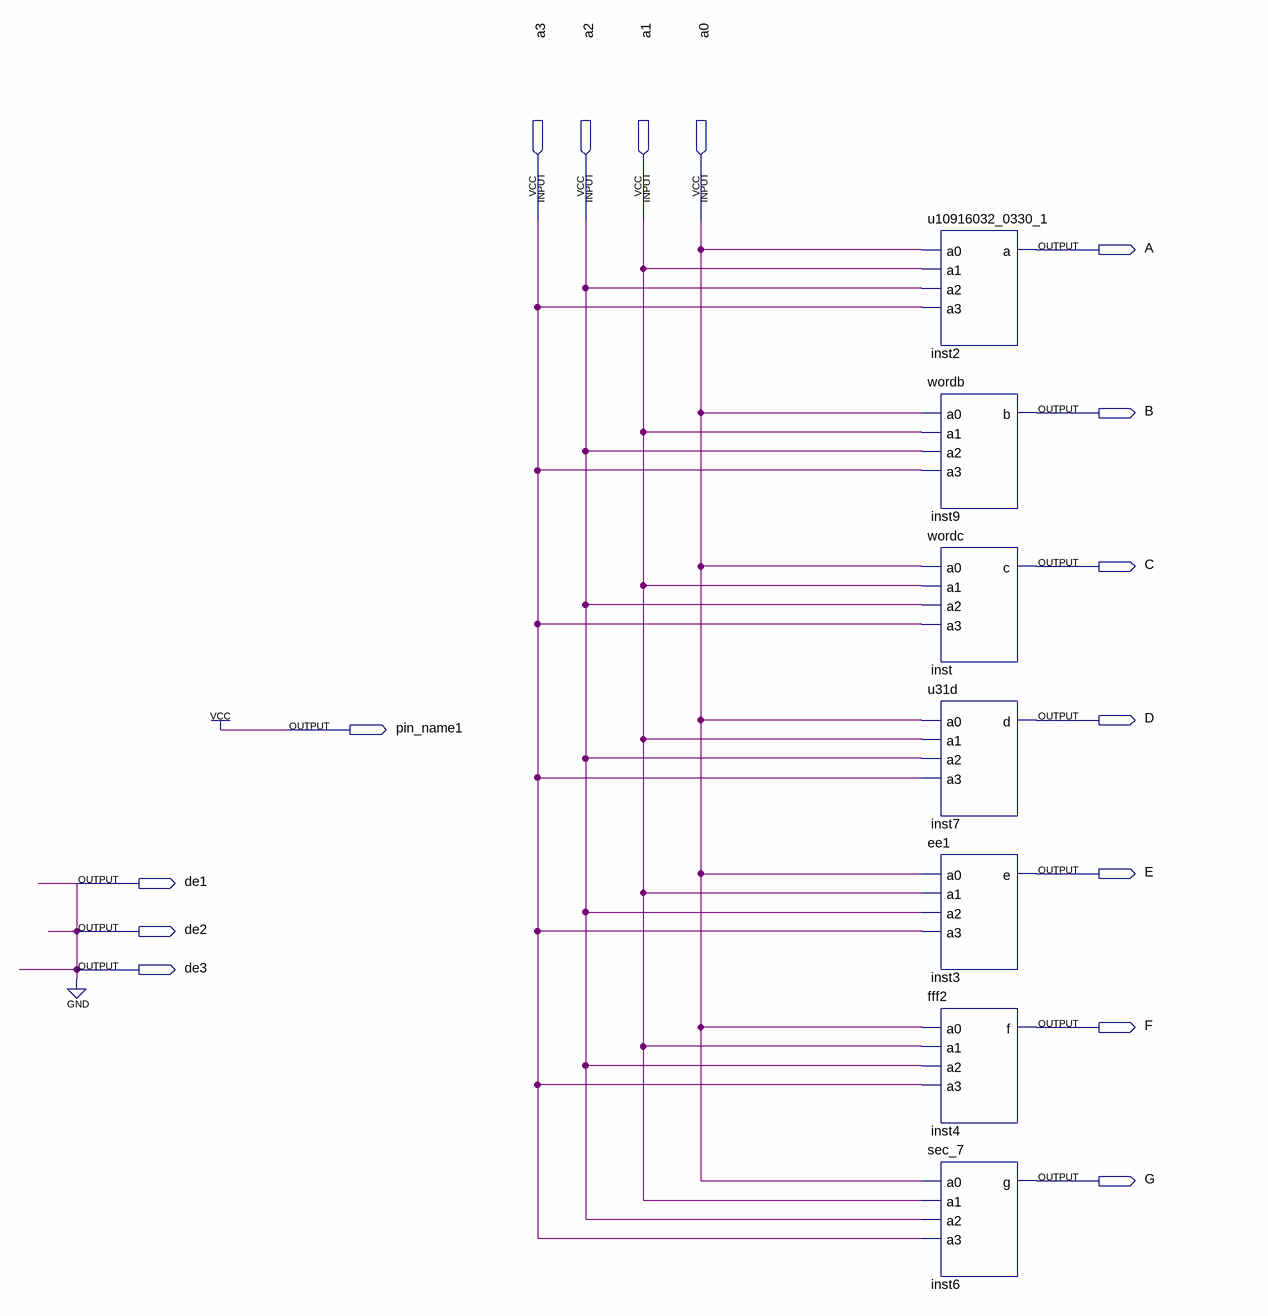
[diagram p0: schematic sheet]
// Quartus schematic Block1.bdf as structural Verilog: 7 symbols, 15 pins
module Block1 (
  input  a3,
  input  a2,
  input  a1,
  input  a0,
  output A,
  output B,
  output C,
  output D,
  output pin_name1,
  output E,
  output de1,
  output de2,
  output de3,
  output F,
  output G
);

  u10916032_0330_1 inst2 (.a0(a0), .a1(a1), .a2(a2), .a3(a3), .a(A));
  wordb inst9 (.a0(a0), .a1(a1), .a2(a2), .a3(a3), .b(B));
  wordc inst (.a0(a0), .a1(a1), .a2(a2), .a3(a3), .c(C));
  u31d inst7 (.a0(a0), .a1(a1), .a2(a2), .a3(a3), .d(D));
  ee1 inst3 (.a0(a0), .a1(a1), .a2(a2), .a3(a3), .e(E));
  fff2 inst4 (.a0(a0), .a1(a1), .a2(a2), .a3(a3), .f(F));
  sec_7 inst6 (.a0(a0), .a1(a1), .a2(a2), .a3(a3), .g(G));

  assign de1 = 1'b0;
  assign de2 = 1'b0;
  assign de3 = 1'b0;
  assign pin_name1 = 1'b1;
endmodule
